# Altium schematic sheet uC.SchDoc
size A4; DocumentNumber: 5; SheetNumber: 5; SheetTotal: 5
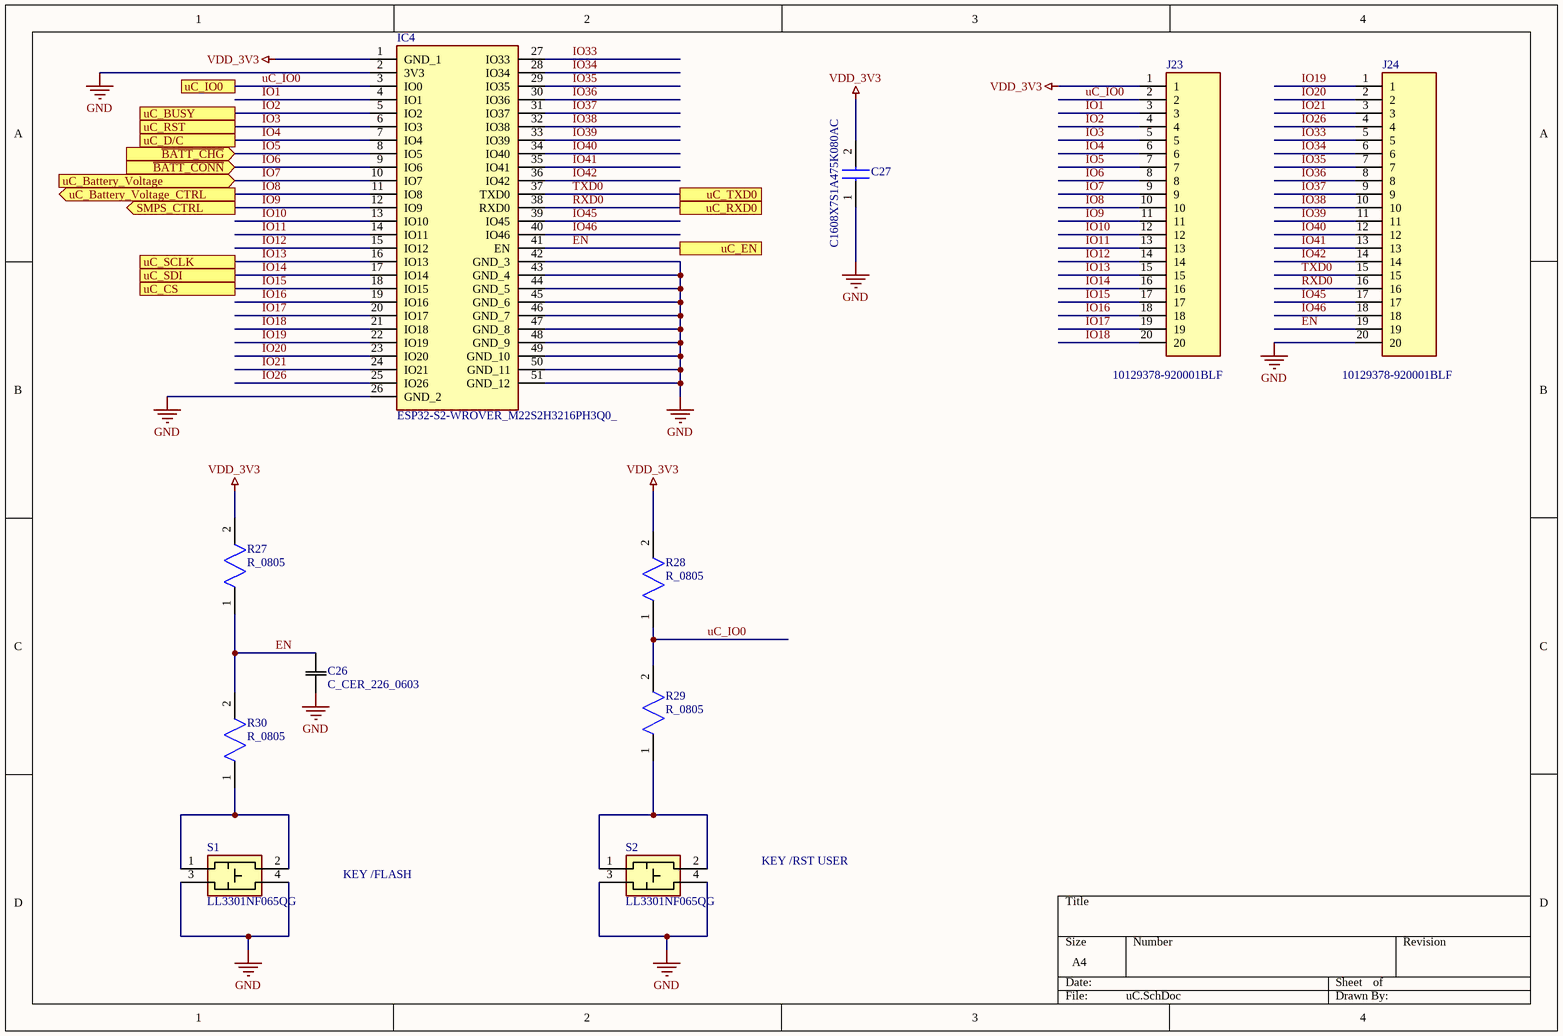
[diagram p0: uC.SchDoc]

## Parts
C26  C_CER_226_0603  [CAPC1608X90N]
C27  C1608X7S1A475K080AC  [CAPC1608X90N]
IC4  ESP32-S2-WROVER_M22S2H3216PH3Q0_  [ESP32S2WROVERM22S2H3216PH3Q0]
J23  10129378-920001BLF  [HDRV20W67P0X254_1X20_5080X241X858P]
J24  10129378-920001BLF  [HDRV20W67P0X254_1X20_5080X241X858P]
R27  R_0805  [RESC2012X55N]
R28  R_0805  [RESC2012X55N]
R29  R_0805  [RESC2012X55N]
R30  R_0805  [RESC2012X55N]
S1  LL3301NF065QG  [LL3301NF065QG]
S2  LL3301NF065QG  [LL3301NF065QG]

## Ports
SMPS_CTRL (out), uC_Battery_Voltage (in), uC_Battery_Voltage_CTRL (out), uC_BUSY, uC_CS, uC_D/C, uC_EN, uC_IO0, uC_RST, uC_RXD0, uC_SCLK, uC_SDI, uC_TXD0, ~{BATT_CHG} (in), ~{BATT_CONN} (in)

## Nets
GND: C26.1 C27.1 IC4.2(3V3) IC4.26(GND_2) IC4.42(GND_3) IC4.43(GND_4) IC4.44(GND_5) IC4.45(GND_6) IC4.46(GND_7) IC4.47(GND_8) IC4.48(GND_9) IC4.49(GND_10) IC4.50(GND_11) IC4.51(GND_12) J24.20 S1.3 S1.4 S2.3 S2.4
VDD_3V3: C27.2 IC4.1(GND_1) J23.1 R27.2 R28.2
EN: C26.2 IC4.41(EN) J24.19 R27.1 R30.2 ; port uC_EN
IO1: IC4.4(IO1) J23.3
IO2: IC4.5(IO2) J23.4 ; port uC_BUSY
IO3: IC4.6(IO3) J23.5 ; port uC_RST
IO4: IC4.7(IO4) J23.6 ; port uC_D/C
IO5: IC4.8(IO5) J23.7 ; port ~{BATT_CHG}
IO6: IC4.9(IO6) J23.8 ; port ~{BATT_CONN}
IO7: IC4.10(IO7) J23.9 ; port uC_Battery_Voltage
IO8: IC4.11(IO8) J23.10 ; port uC_Battery_Voltage_CTRL
IO9: IC4.12(IO9) J23.11 ; port SMPS_CTRL
IO10: IC4.13(IO10) J23.12
IO11: IC4.14(IO11) J23.13
IO12: IC4.15(IO12) J23.14
IO13: IC4.16(IO13) J23.15 ; port uC_SCLK
IO14: IC4.17(IO14) J23.16 ; port uC_SDI
IO15: IC4.18(IO15) J23.17 ; port uC_CS
IO16: IC4.19(IO16) J23.18
IO17: IC4.20(IO17) J23.19
IO18: IC4.21(IO18) J23.20
IO19: IC4.22(IO19) J24.1
IO20: IC4.23(IO20) J24.2
IO21: IC4.24(IO21) J24.3
IO26: IC4.25(IO26) J24.4
IO33: IC4.27(IO33) J24.5
IO34: IC4.28(IO34) J24.6
IO35: IC4.29(IO35) J24.7
IO36: IC4.30(IO36) J24.8
IO37: IC4.31(IO37) J24.9
IO38: IC4.32(IO38) J24.10
IO39: IC4.33(IO39) J24.11
IO40: IC4.34(IO40) J24.12
IO41: IC4.35(IO41) J24.13
IO42: IC4.36(IO42) J24.14
IO45: IC4.39(IO45) J24.17
IO46: IC4.40(IO46) J24.18
RXD0: IC4.38(RXD0) J24.16 ; port uC_RXD0
TXD0: IC4.37(TXD0) J24.15 ; port uC_TXD0
uC_IO0: IC4.3(IO0) J23.2 R28.1 R29.2 ; port uC_IO0
NetR29_1: R29.1 S2.1 S2.2
NetR30_1: R30.1 S1.1 S1.2

## Notes on the sheet
- KEY /FLASH
- KEY /RST USER

## Library data of the parts
C26 = C_CER_226_0603: Manufacturer_Part_Number: GRM188R60J226MEA0D; Vendor: Murata; SourceLibrary: Murata_2014-12-31; Type: DEV; Copyright: Copyright (C) 2015 Accelerated Designs. All rights reserved; RefDes: RefDes
C27 = C1608X7S1A475K080AC: Capacitor; Manufacturer_Name: TDK; Datasheet Link: https://product.tdk.com/info/en/catalog/datasheets/mlcc_commercial_midvoltage_en.pdf; Height: 0.9mm; Manufacturer_Part_Number: C1608X7S1A475K080AC
IC4 = ESP32-S2-WROVER_M22S2H3216PH3Q0_: Integrated Circuit; Manufacturer_Name: Espressif Systems; Manufacturer_Part_Number: ESP32-S2-WROVER(M22S2H3216PH3Q0); Datasheet Link: https://www.espressif.com/sites/default/files/documentation/esp32-s2-wrover_esp32-s2-wrover-i_datasheet_en.pdf; Height: 3.45mm
J23 J24 = 10129378-920001BLF: Connector; Manufacturer_Name: Amphenol; Datasheet Link: https://cdn.amphenol-icc.com/media/wysiwyg/files/drawing/10129378.pdf; Height: 8.58mm; Manufacturer_Part_Number: 10129378-920001BLF
R27-R30 = R_0805: Resistor; Manufacturer_Name: Vishay; Datasheet Link: http://www.vishay.com/docs/20035/dcrcwe3.pdf; Height: 0.4mm
S1 S2 = LL3301NF065QG: Switch; Manufacturer_Name: E-Switch; Datasheet Link: https://componentsearchengine.com//LL3301NF065QG.pdf; Height: 4mm; Mouser2 Part Number: 612-LL3301NF065QG; Mouser2 Price/Stock: https://www.mouser.com/Search/Refine.aspx?Keyword=612-LL3301NF065QG; Manufacturer_Part_Number: LL3301NF065QG